# Altium project Sterilizatorul.PrjPcb
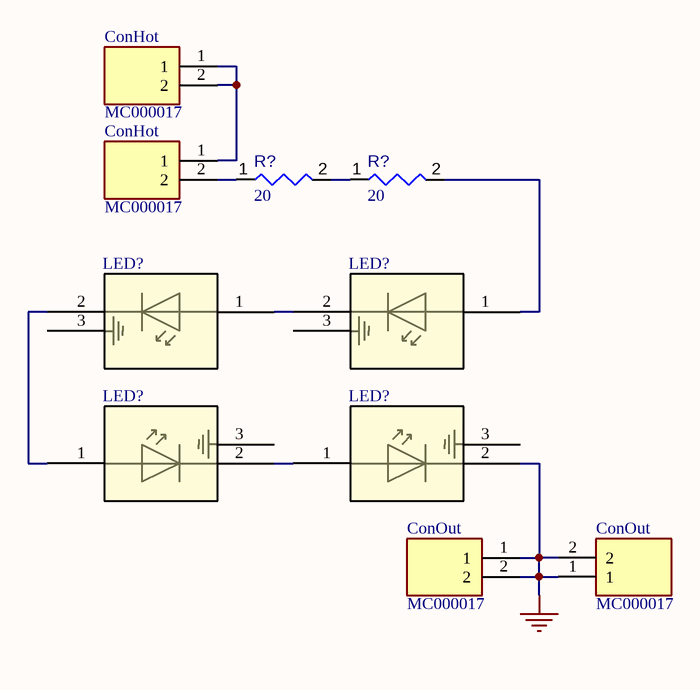
[diagram p0: LED Matrix.SchDoc]
1 sheet, 10 parts. Net scope: global (net labels, ports and power ports of the same name join across sheets).
Board file: PCB1.PcbDoc

## Sheet LED Matrix.SchDoc
size A; SheetNumber: 1; SheetTotal: 1

### Parts
(Parts that share a designator on the sheet are numbered #1, #2 ... from top to bottom, then left to right.)
ConHot#1  MC000017  [MC000017]
ConHot#2  MC000017  [MC000017]
ConOut#1  MC000017  [MC000017]
ConOut#2  MC000017  [MC000017]
LED?#1  CULBN2.VC-AGAM-67-4F4G-30-R18  [SUCULBN_OSR]  (value not drawn)
LED?#2  U CULBN2.VC-AGAM-67-4F4G-30-R18  [SUCULBN_OSR]  (value not drawn)
LED?#3  SU CULBN2.VC-AGAM-67-4F4G-30-R18  [SUCULBN_OSR]  (value not drawn)
LED?#4  SU CULBN2.VC-AGAM-67-4F4G-30-R18  [SUCULBN_OSR]  (value not drawn)
R?#1  value 20  (hidden comment: 3430A3F20RTDF)
R?#2  value 20  (hidden comment: 3430A3F20RTDF)

### Nets
GND: ConOut#1.1 ConOut#1.2 ConOut#2.1 ConOut#2.2 LED?#4.2
NetConHot#1_1: ConHot#1.1 ConHot#1.2 ConHot#2.1
NetConHot#2_2: ConHot#2.2 R?#1.1
NetLED?#1_1: LED?#1.1 LED?#2.2
NetLED?#1_2: LED?#1.2 LED?#3.1
NetLED?#2_1: LED?#2.1 R?#2.2
NetLED?#3_2: LED?#3.2 LED?#4.1
NetR?#1_2: R?#1.2 R?#2.1

Not connected (* = marked no-connect by the designer): LED?#1 3; LED?#2 3; LED?#3 3; LED?#4 3

### Library data of the parts
ConHot#1 ConHot#2 ConOut#1 ConOut#2 = MC000017: TERMINAL BLOCK, WIRE TO BRD, 1POS; Manufacturer_Name: Multicomp Pro; Geometry.Height: 9.7mm; Farnell Part Number: *; Farnell Price/Stock: *; Manufacturer_Part_Number: MC000017; Datasheet Link: *
LED?#1-LED?#4 = SU CULBN2.VC-AGAM-67-4F4G-30-R18: Description; Manufacturer_Name: ams OSRAM; Type: LED Emitters; Copyright: Copyright (C) 2025 Ultra Librarian. All rights reserved.; Manufacturer_Part_Number: SU CULBN2.VC-AGAM-67-4F4G-30-R18; RefDes: RefDes
R?#1 R?#2 = CMP-009-00178-1: Fixed Resistor, Metal Glaze/thick Film, 3W, 20ohm, 200V, 1% +/-Tol, 200ppm/Cel, Surface Mount, 1225; Tolerance: 1%; Min Operating Temperature: -55°C; Mounting Technology: Surface Mount; Case/Package: 1225; Max Operating Temperature: 155°C